# Altium schematic sheet [2]_Communication_Inputs.SchDoc: Communication & Inputs
size A4; DocumentNumber: 2; SheetNumber: 2; SheetTotal: 8
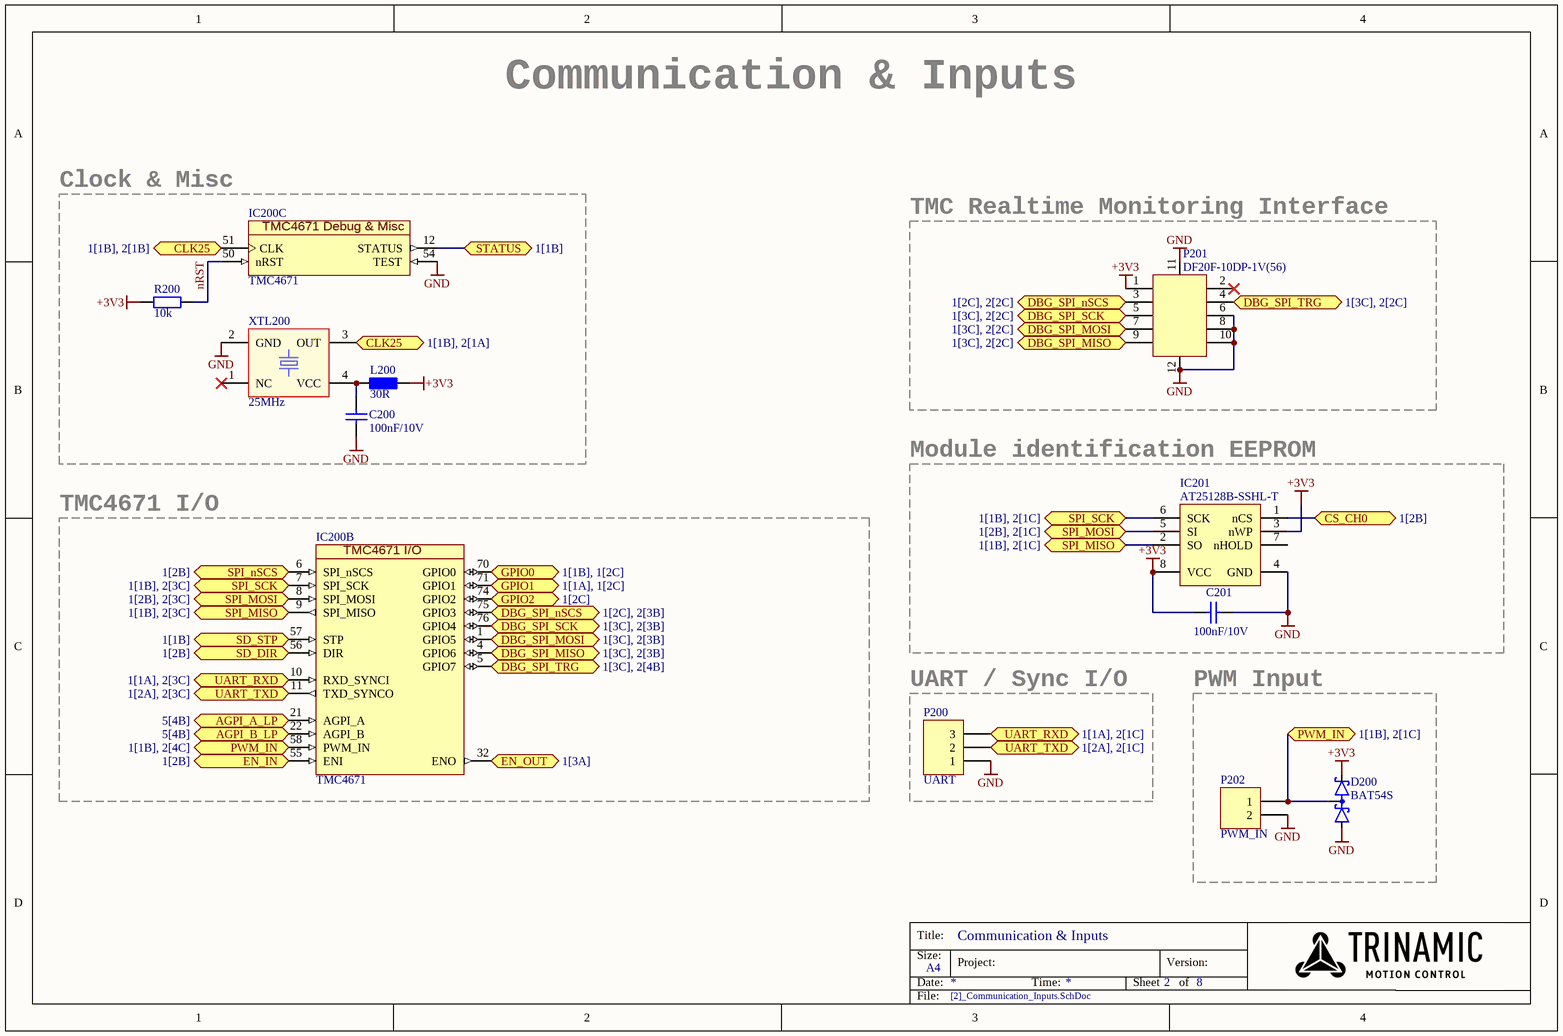
[diagram p0: [2]_Communication_Inputs.SchDoc]

## Parts
C200  100nF/10V  [C0603]
C201  100nF/10V  [C0603]
D200  BAT54S  [SOT95P237X130-3N]
IC200  TMC4671  [QFN40P1050X650X90_HS-77N]  (parts B,C of 5)
IC201  AT25128B-SSHL-T  [SOP127P600X175-8N]
L200  30R  [L0603]
P200  UART  [TH_HDR_1X3]
P201  DF20F-10DP-1V(56)  [CON, TMC Debug SPI]
P202  PWM_IN  [TH_HDR_1X2]
R200  10k  [R0603]
XTL200  25MHz  [FOX924B-25.000]

## Blocks framed on the sheet
Clock & Misc: C200 IC200 L200 R200 XTL200
TMC Realtime Monitoring Interface: P201
TMC4671 I/O: IC200
Module identification EEPROM: C201 IC201
UART / Sync I/O: P200
PWM Input: D200 P202

## Ports
AGPI_A_LP (see 5[4B]), AGPI_B_LP (see 5[4B]), CLK25 (see 1[1B], 2[1A]), CLK25 (see 1[1B], 2[1B]), CS_CH0 (see 1[2B]), DBG_SPI_MISO (see 1[3C], 2[2C]), DBG_SPI_MISO (see 1[3C], 2[3B]), DBG_SPI_MOSI (see 1[3C], 2[2C]), DBG_SPI_MOSI (see 1[3C], 2[3B]), DBG_SPI_nSCS (see 1[2C], 2[2C]), DBG_SPI_nSCS (see 1[2C], 2[3B]), DBG_SPI_SCK (see 1[3C], 2[2C]), DBG_SPI_SCK (see 1[3C], 2[3B]), DBG_SPI_TRG (see 1[3C], 2[2C]), DBG_SPI_TRG (see 1[3C], 2[4B]), EN_IN (see 1[2B]), EN_OUT (see 1[3A]), GPIO0 (see 1[1B], 1[2C]), GPIO1 (see 1[1A], 1[2C]), GPIO2 (see 1[2C]), PWM_IN (see 1[1B], 2[1C]), PWM_IN (see 1[1B], 2[4C]), SD_DIR (see 1[2B]), SD_STP (see 1[1B]), SPI_MISO (see 1[1B], 2[1C]), SPI_MISO (see 1[1B], 2[3C]), SPI_MOSI (see 1[2B], 2[1C]), SPI_MOSI (see 1[2B], 2[3C]), SPI_nSCS (see 1[2B]), SPI_SCK (see 1[1B], 2[1C]), SPI_SCK (see 1[1B], 2[3C]), STATUS (see 1[1B]), UART_RXD (see 1[1A], 2[1C]), UART_RXD (see 1[1A], 2[3C]), UART_TXD (see 1[2A], 2[1C]), UART_TXD (see 1[2A], 2[3C])

## Nets
+3V3: C201.2 D200.2(C2) IC201.3(nWP) IC201.8(VCC) L200.1 P201.1 R200.2
GND: C200.2 C201.1 D200.1(A1) IC200.54(TEST) IC201.4(GND) P200.1 P201.6 P201.8 P201.10 P201.11 P201.12 P202.2 XTL200.2(GND)
AGPI_A_LP: IC200.21(AGPI_A) ; port AGPI_A_LP
AGPI_B_LP: IC200.22(AGPI_B) ; port AGPI_B_LP
CLK25: IC200.51(CLK) XTL200.3(OUT) ; port CLK25
CS_CH0: IC201.1(nCS) ; port CS_CH0
DBG_SPI_MISO: IC200.4(GPIO6) P201.9 ; port DBG_SPI_MISO
DBG_SPI_MOSI: IC200.1(GPIO5) P201.7 ; port DBG_SPI_MOSI
DBG_SPI_nSCS: IC200.75(GPIO3) P201.3 ; port DBG_SPI_nSCS
DBG_SPI_SCK: IC200.76(GPIO4) P201.5 ; port DBG_SPI_SCK
DBG_SPI_TRG: IC200.5(GPIO7) P201.4 ; port DBG_SPI_TRG
EN_IN: IC200.55(ENI) ; port EN_IN
EN_OUT: IC200.32(ENO) ; port EN_OUT
GPIO0: IC200.70(GPIO0) ; port GPIO0
GPIO1: IC200.71(GPIO1) ; port GPIO1
GPIO2: IC200.74(GPIO2) ; port GPIO2
nRST: IC200.50(nRST) R200.1
PWM_IN: D200.3(C1A2) IC200.58(PWM_IN) P202.1 ; port PWM_IN
SD_DIR: IC200.56(DIR) ; port SD_DIR
SD_STP: IC200.57(STP) ; port SD_STP
SPI_MISO: IC200.9(SPI_MISO) IC201.2(SO) ; port SPI_MISO
SPI_MOSI: IC200.8(SPI_MOSI) IC201.5(SI) ; port SPI_MOSI
SPI_nSCS: IC200.6(SPI_nSCS) ; port SPI_nSCS
SPI_SCK: IC200.7(SPI_SCK) IC201.6(SCK) ; port SPI_SCK
STATUS: IC200.12(STATUS) ; port STATUS
UART_RXD: IC200.10(RXD_SYNCI) P200.3 ; port UART_RXD
UART_TXD: IC200.11(TXD_SYNCO) P200.2 ; port UART_TXD
NetC200_1: C200.1 L200.2 XTL200.4(VCC)

Not connected (* = marked no-connect by the designer): IC201 7(nHOLD); P201 2*; XTL200 1(NC)*

## Notes on the sheet
- Title:
- Size:
- Date:
- A4
- Project:
- Time:
- Sheet
- Version:
- of
- File:
- (in symbol TMC4671, part B) TMC4671 I/O
- (in symbol TMC4671, part C) TMC4671 Debug & Misc

## Library data of the parts
C200 C201 = C, 0.1 µF, 10 V, ± 10%, X7R, 0603: SMD Multilayer Ceramic Capacitor, 0603 [1608 Metric], 0.1 µF, 10 V, ± 10%, X7R, MC Series; MPN: MC0603B104K100CT; Type: MLCC; VoltageRating: 10V; MF: Multicomp; Capacitance: 100nF; Characteristic: X7R; ComponentLinknURL: *; Precision: 10%
D200 = BAT54S: Small Signal Schottky Diode, Dual Series, 30 V, 200 mA, 1 V, 600 mA, 125 °C; MF: TAIWAN SEMICONDUCTOR; MPN: BAT54S
IC200 = TMC4671: MF: TRINAMIC; MPN: TMC4671
IC201 = EEPROM_ AT25128B-SSHL-T: EEPROM, SPI, 128 Kbit, 16K x 8bit, 20 MHz, SOIC, 8 Pins; MF: MICROCHIP; MPN: AT25128B-SSHL-T
L200 = FB, 30 ohm, 0603 [1608 Metric], MFB Series, 3 A, 0.04 ohm, ± 25%: Ferrite Bead, 30 ohm, 0603 [1608 Metric], MFB Series, 3 A, 0.04 ohm, ± 25%; MPN: MFB-160808-0030PQ; MF: MEC MARCOM; DC Current Rating: 3A; DC Resistance Max:: 0R04; Tolerance: ±25%; Impedance: 30R
P200 = Header 3: Header, 3-Pin; Note: Not fitted
P201 = CON, TMC Debug SPI: Wire-To-Board Connector, 1 mm, 10 Contacts, Header, DF20 Series, Surface Mount, 2 Rows; MF: Hirose Electric Co Ltd; MPN: DF20F-10DP-1V(56)
P202 = Header 2: Header, 2-Pin; Note: Not fitted
R200 = R, 10 kohm, 50 V, 0603 [1608 Metric], 63 mW, ± 1%, MC Series: SMD Chip Resistor, Thick Film, 10 kohm, 50 V, 0603 [1608 Metric], 63 mW, ± 1%, MC Series; MPN: MC0063W0603110K; VoltageRating: 50V; Temp coefficient: *ppm; PowerRating: 63mW; MF: MULTICOMP; Precision: 1%; Resistance: 10k
XTL200 = 25 MHz, 2.5 ppm, SMD, 5mm x 3.2mm, HCMOS, 3.3 V, FOX924 Series: TCXO, 25 MHz, 2.5 ppm, SMD, 5mm x 3.2mm, HCMOS, 3.3 V, FOX924 Series; MF: FOX ELECTRONICS; Freq. Stability: 2.5ppm; Op.temp.: -30°C...+80°C; MPN: FOX924B-25.000; Freq.: 25MHz